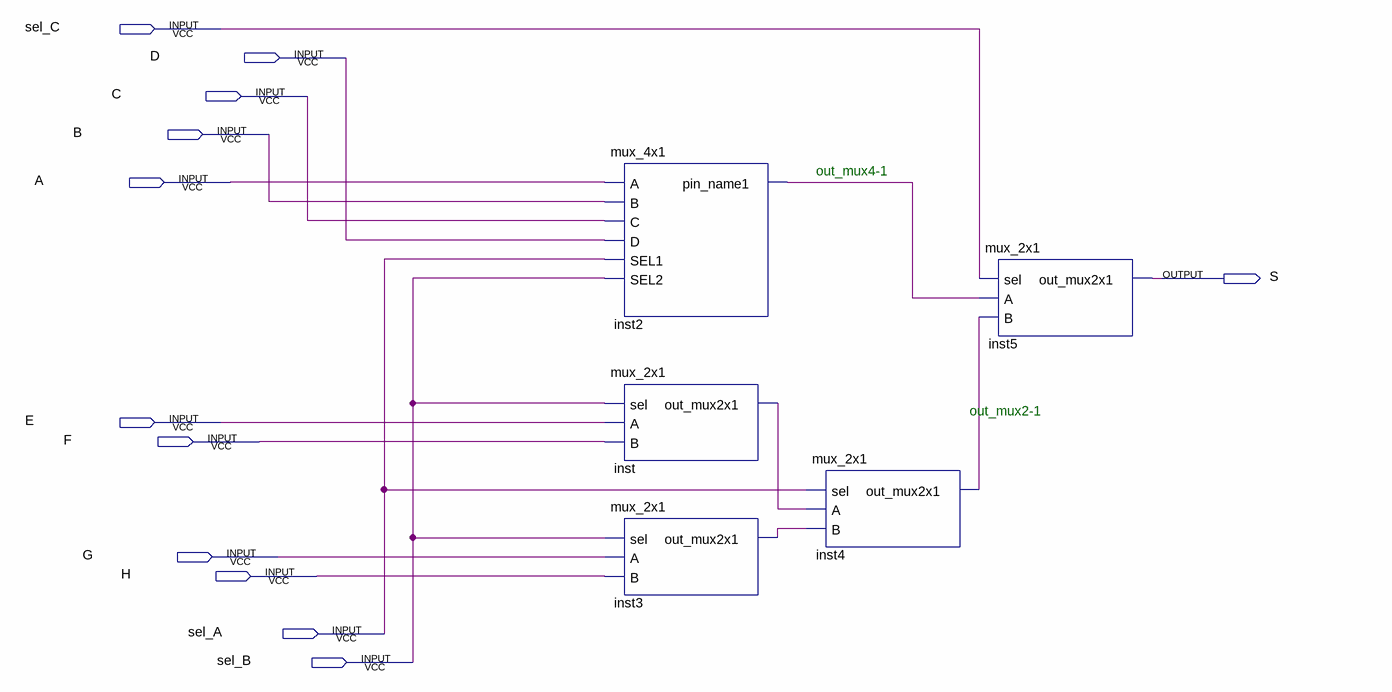
[diagram p0: schematic sheet]
// Quartus schematic mux_8x1.bdf as structural Verilog: 5 symbols, 12 pins
module mux_8x1 (
  input  sel_C,
  input  D,
  input  C,
  input  B,
  input  A,
  input  E,
  input  F,
  input  G,
  input  H,
  input  sel_A,
  input  sel_B,
  output S
);

  wire inst2_pin_name1, inst3_out_mux2x1, inst4_out_mux2x1, inst_out_mux2x1;

  mux_4x1 inst2 (.A(A), .B(B), .C(C), .D(D), .SEL1(sel_A), .SEL2(sel_B), .pin_name1(inst2_pin_name1));
  mux_2x1 inst (.sel(sel_B), .A(E), .B(F), .out_mux2x1(inst_out_mux2x1));
  mux_2x1 inst3 (.sel(sel_B), .A(G), .B(H), .out_mux2x1(inst3_out_mux2x1));
  mux_2x1 inst4 (.sel(sel_A), .A(inst_out_mux2x1), .B(inst3_out_mux2x1), .out_mux2x1(inst4_out_mux2x1));
  mux_2x1 inst5 (.sel(sel_C), .A(inst2_pin_name1), .B(inst4_out_mux2x1), .out_mux2x1(S));

  // Notes on the sheet:
  //   out_mux4-1
  //   out_mux2-1
endmodule
